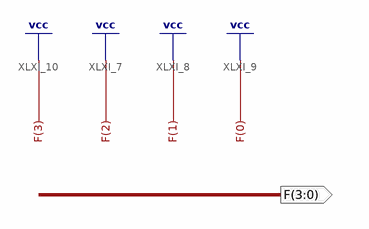
[diagram p0: schematic sheet 1]
// Xilinx ISE schematic Const_F.sch (spartan6) as structural Verilog: 0 symbols, 1 ports
module Const_F (
  output [3:0] F
);


  assign F = 4'b1111;
endmodule
